# Altium schematic sheet USB.SchDoc
size A
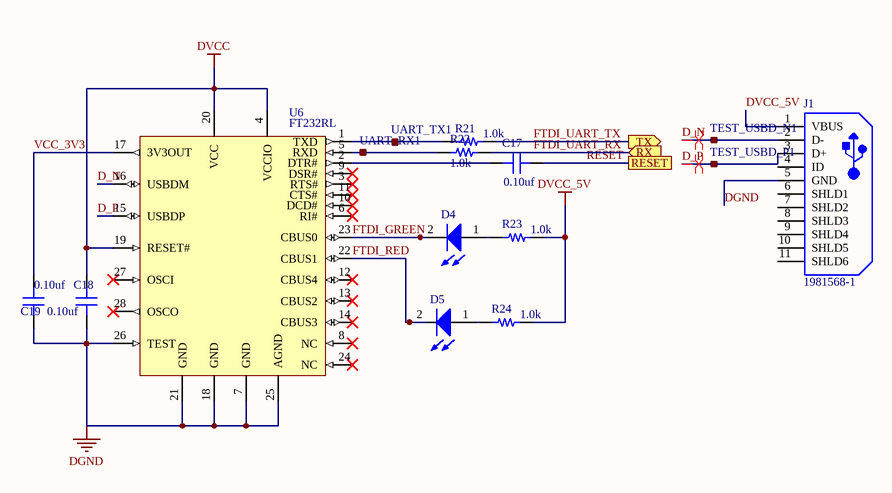
[diagram p0: USB.SchDoc]

## Parts
C17  value 0.10uf  [CAP 0603/1608]  (hidden comment: Capacitor MLCC 0.10uf 25V CAP 0603/1608)
C18  value 0.10uf  [CAP 0603/1608]  (hidden comment: Capacitor MLCC 0.10uf 25V CAP 0603/1608)
C19  value 0.10uf  [CAP 0603/1608]  (hidden comment: Capacitor MLCC 0.10uf 25V CAP 0603/1608)
D4  (no value)  [0805_LED]
D5  (no value)  [0805_LED]
J1  1981568-1  [TECO-1981568-5_V]
R21  value 1.0k  [RES 0805/2012]  (hidden comment: Resistor 1.0k 0805 1/4W 1%)
R22  value 1.0k  [RES 0805/2012]  (hidden comment: Resistor 1.0k 0805 1/4W 1%)
R23  value 1.0k  [RES 0805/2012]  (hidden comment: Resistor 1.0k 0805 1/4W 1%)
R24  value 1.0k  [RES 0805/2012]  (hidden comment: Resistor 1.0k 0805 1/4W 1%)
TEST_USBD_N1  RCU-0C  [RCU-0C]  (value not drawn)
TEST_USBD_P1  RCU-0C  [RCU-0C]  (value not drawn)
U6  FT232RL  [SSOP-28]
UART_RX1  RCU-0C  [RCU-0C]  (value not drawn)
UART_TX1  RCU-0C  [RCU-0C]  (value not drawn)

## Ports
RESET, RX (in), TX (out)

## Nets
DGND: C18.1 C19.1 J1.5(GND) U6.7(GND) U6.18(GND) U6.21(GND) U6.25(AGND) U6.26(TEST)
DVCC: C18.2 U6.4(VCCIO) U6.19(RESET#) U6.20(VCC)
DVCC_5V: J1.1(VBUS) R23.2 R24.2
D_N: J1.2(D-) TEST_USBD_N1.1 U6.16(USBDM)
D_P: J1.3(D+) TEST_USBD_P1.1 U6.15(USBDP)
FTDI_GREEN: D4.2(K) U6.23(CBUS0)
FTDI_RED: D5.2(K) U6.22(CBUS1)
FTDI_UART_RX: R22.2 ; port RX
FTDI_UART_TX: R21.2 ; port TX
RESET: C17.2 ; port RESET
VCC_3V3: C19.2 U6.17(3V3OUT)
NetC17_1: C17.1 U6.2(DTR#)
NetD4_1: D4.1(A) R23.1
NetD5_1: D5.1(A) R24.1
NetR21_1: R21.1 U6.1(TXD) UART_TX1.1
NetR22_1: R22.1 U6.5(RXD) UART_RX1.1

Not connected (* = marked no-connect by the designer): J1 4(ID) 6(SHLD1) 7(SHLD2) 8(SHLD3) 9(SHLD4) 10(SHLD5) 11(SHLD6); U6 3(RTS#)* 6(RI#)* 8(NC)* 9(DSR#)* 10(DCD#)* 11(CTS#)* 12(CBUS4)* 13(CBUS2)* 14(CBUS3)* 24(NC)* 27(OSCI)* 28(OSCO)*

## Layout directives
differential pair; rule Matched Net Lengths [Tolerance = 0.254mm]: D_N
differential pair: D_P

## Library data of the parts
C17-C19 = 583: Manufacturer_id: 1; idCapacitor: 583; Name: Cap_0.10uf_25V_CAP 0603/1608; Dielectric: Ceramic; Created_By: Nick Mah; Drawer_id: 1; Voltage_Rating: 25V; Package: CAP 0603/1608; Created_Date: 10/20/2018
D4 = 2: Manufacturer_id: 1; idLED: 2; Name: CMD17_0805_GREEN; Value: Green; Brightness: 7mcd; Id: 20mA; Vf: 2.1V; Drawer_id: 1; Link: https://www.digikey.com/product-detail/en/visual-communications-company-vcc/CMD17-21VGD-TR8/L62505CT-ND/254936; Package: 0805
D5 = 1: idLED: 1; Name: LED_0805_RED; Value: Red; Vf: 0.7V; Manufacturer_id: 1; Drawer_id: 1; Package: 0805
J1 = 5: USB Micro Type B; Manufacturer_id: 1; idConn: 5; Name: TE USB Micro; Value: CONN; Created_By: Aiku; MfrPartNo: 1981568-1; Drawer_id: 1; Num_Contacts: 5; Link: https://www.mouser.com/ProductDetail/TE-Connectivity-AMP/1981568-1?qs=sGAEpiMZZMulM8LPOQ%252bykzEIUPbUCiSfqsfxH3Oq%252bYo%3d; ComponentLink1Description: Datasheet; Supplier1: TE; Created_Date: 10/20/2018
R21-R24 = 721: Manufacturer_id: 1; idResistor: 721; Name: Res_1.0k_0805_1/4W_1%; Created_By: Nick Mah; Supplier 1: Digi-Key; Drawer_id: 1; Tolerance: 1%; Power: 1/4W; Package: 0805; ComponentLink1Description: Datasheet; Created_Date: 2018-10-20
TEST_USBD_N1 TEST_USBD_P1 UART_RX1 UART_TX1 = 5: Manufacturer_id: 1; idTable: 5; Name: RCU-0C_Test_Point; Drawer_id: 1; Package: 0603; MfrPartNo: RCU-0C; Link: https://www.digikey.com/product-detail/en/te-connectivity-amp-connectors/RCU-0C/A106145CT-ND/3477802; ComponentLink1Description: Datasheet; ComponentLink1URL: https://www.te.com/commerce/DocumentDelivery/DDEController?Action=srchrtrv&DocNm=1773266&DocType=DS&DocLang=English
U6 = 3: Manufacturer_id: 1; idIC_Interface: 3; Name: USB FTDI; Protocol: UART; Vin(Min): 3.3; Vin(Max): 5.25; Created_By: Kyle; Drawer_id: 1; MfrPartNo: FT232RL; Link: https://www.digikey.com/product-detail/en/ftdi-future-technology-devices-international-ltd/FT232RL-REEL/768-1007-1-ND/1836402